# Altium schematic sheet Overview.SchDoc
size A4; SheetNumber: 1; SheetTotal: 4
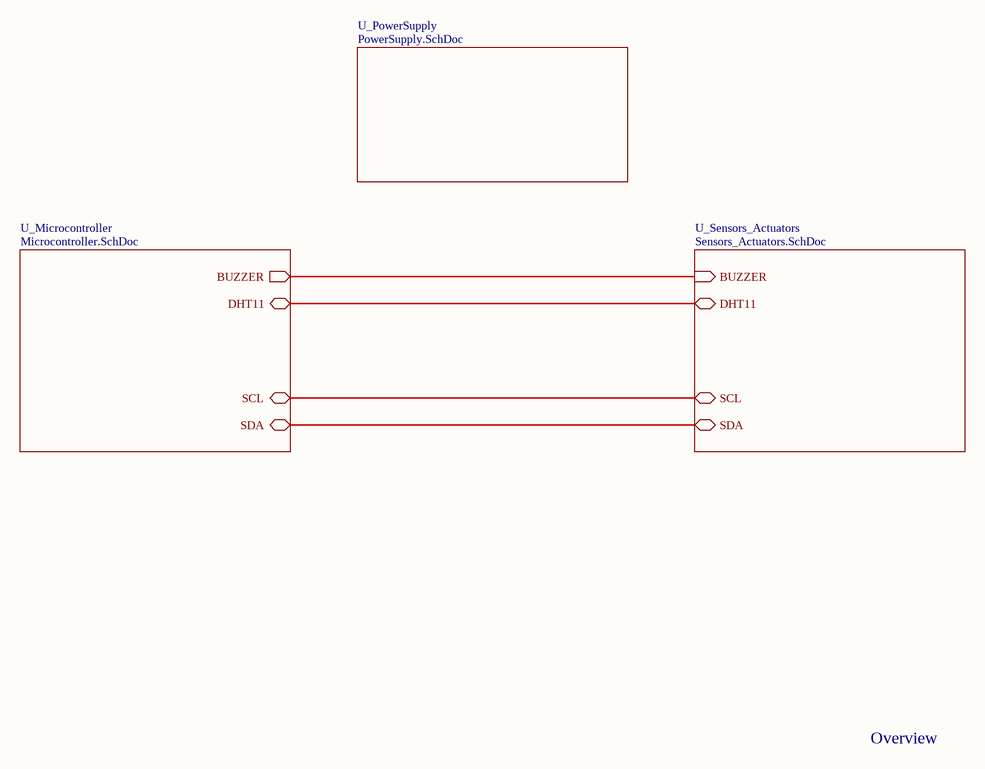
[diagram p0: Overview.SchDoc]

## Sub-sheets
U_Microcontroller = Microcontroller.SchDoc: DHT11 (bidir), BUZZER (out), SDA (bidir), SCL (bidir)
U_PowerSupply = PowerSupply.SchDoc: no entries
U_Sensors_Actuators = Sensors_Actuators.SchDoc: SDA (bidir), DHT11 (bidir), SCL (bidir), BUZZER (in)

## Nets
(unnamed): sheet U_Microcontroller/DHT11, sheet U_Sensors_Actuators/DHT11
(unnamed): sheet U_Microcontroller/BUZZER, sheet U_Sensors_Actuators/BUZZER
(unnamed): sheet U_Microcontroller/SDA, sheet U_Sensors_Actuators/SDA
(unnamed): sheet U_Microcontroller/SCL, sheet U_Sensors_Actuators/SCL

## Notes on the sheet
- Overview